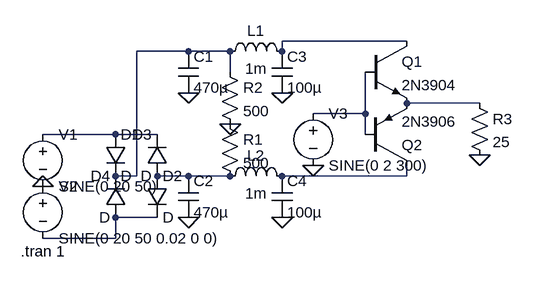
[diagram p0: schematic classB.asc]
classB.asc, the LTspice schematic file:
Version 4
SHEET 1 880 680
WIRE 608 -16 416 -16
WIRE 272 0 192 0
WIRE 336 0 272 0
WIRE 416 0 416 -16
WIRE 336 32 336 0
WIRE 720 80 608 80
WIRE 544 96 544 32
WIRE 544 96 464 96
WIRE 160 128 48 128
WIRE 224 128 160 128
WIRE 544 128 544 96
WIRE 192 192 192 0
WIRE 192 192 160 192
WIRE 272 192 224 192
WIRE 336 192 272 192
WIRE 608 192 608 176
WIRE 608 192 416 192
WIRE 224 256 160 256
WIRE 160 288 160 256
WIRE 160 288 48 288
FLAG 48 208 0
FLAG 272 256 0
FLAG 272 64 0
FLAG 336 112 0
FLAG 464 176 0
FLAG 416 64 0
FLAG 416 256 0
FLAG 720 160 0
SYMBOL voltage 48 112 R0
WINDOW 123 0 0 Left 0
WINDOW 39 0 0 Left 0
SYMATTR InstName V1
SYMATTR Value SINE(0 20 50)
SYMBOL voltage 48 192 R0
WINDOW 123 0 0 Left 0
WINDOW 39 0 0 Left 0
SYMATTR InstName V2
SYMATTR Value SINE(0 20 50 0.02 0 0)
SYMBOL diode 144 128 R0
SYMATTR InstName D1
SYMBOL diode 208 192 R0
SYMATTR InstName D2
SYMBOL diode 240 192 R180
WINDOW 0 24 64 Left 2
WINDOW 3 24 0 Left 2
SYMATTR InstName D3
SYMBOL diode 176 256 R180
WINDOW 0 24 64 Left 2
WINDOW 3 24 0 Left 2
SYMATTR InstName D4
SYMBOL cap 256 0 R0
SYMATTR InstName C1
SYMATTR Value 470µ
SYMBOL cap 256 192 R0
SYMATTR InstName C2
SYMATTR Value 470µ
SYMBOL res 320 96 R0
SYMATTR InstName R1
SYMATTR Value 500
SYMBOL res 320 16 R0
SYMATTR InstName R2
SYMATTR Value 500
SYMBOL voltage 464 80 R0
WINDOW 123 0 0 Left 0
WINDOW 39 0 0 Left 0
SYMATTR InstName V3
SYMATTR Value SINE(0 2 300)
SYMBOL npn 544 -16 R0
SYMATTR InstName Q1
SYMATTR Value 2N3904
SYMBOL pnp 544 176 M180
SYMATTR InstName Q2
SYMATTR Value 2N3906
SYMBOL ind 320 208 R270
WINDOW 0 32 56 VTop 2
WINDOW 3 5 56 VBottom 2
SYMATTR InstName L2
SYMATTR Value 1m
SYMATTR SpiceLine Ipk=0.1 Rser=21
SYMBOL ind 320 16 R270
WINDOW 0 32 56 VTop 2
WINDOW 3 5 56 VBottom 2
SYMATTR InstName L1
SYMATTR Value 1m
SYMATTR SpiceLine Ipk=0.1 Rser=21
SYMBOL cap 400 0 R0
SYMATTR InstName C3
SYMATTR Value 100µ
SYMBOL cap 400 192 R0
SYMATTR InstName C4
SYMATTR Value 100µ
SYMBOL res 704 64 R0
SYMATTR InstName R3
SYMATTR Value 25
TEXT 14 308 Left 2 !.tran 1

The netlist it stands for:
* classB.asc
V1 N005 0 SINE(0 20 50)
V2 0 N008 SINE(0 20 50 0.02 0 0)
D1 N005 N002 D
D2 N006 N008 D
D3 N006 N005 D
D4 N008 N002 D
C1 N002 0 470µ
C2 N006 0 470µ
R1 0 N006 500
R2 N002 0 500
V3 N004 0 SINE(0 2 300)
Q1 N001 N004 N003 0 2N3904
Q2 N007 N004 N003 0 2N3906
L2 N006 N007 1m Ipk=0.1 Rser=21
L1 N002 N001 1m Ipk=0.1 Rser=21
C3 N001 0 100µ
C4 N007 0 100µ
R3 N003 0 25
.model D D
.lib standard.dio
.model NPN NPN
.model PNP PNP
.lib standard.bjt
.tran 1
.backanno
.end